# EAGLE design rpi (EAGLE 6.4)
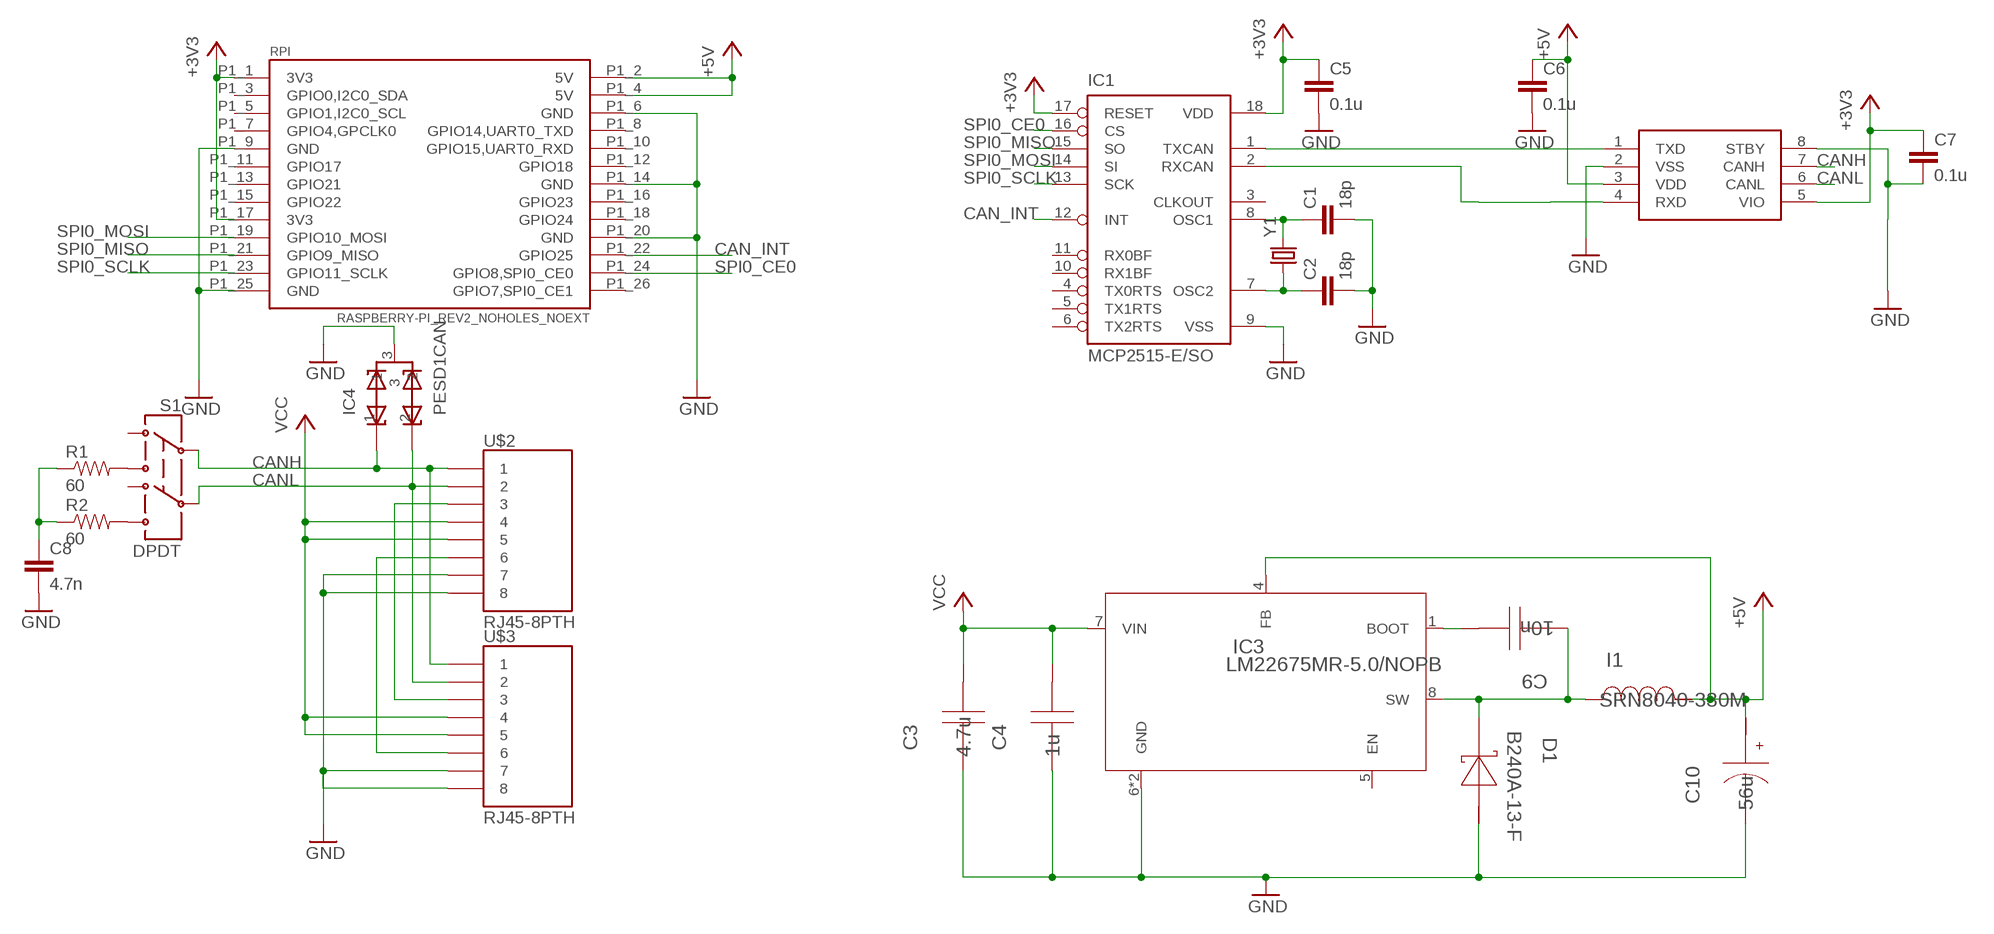
[diagram p0: schematic, sheet 1]

## Parts
C1  18p  CAP0603-CAP  [0603-CAP]
C2  18p  CAP0603-CAP  [0603-CAP]
C3  4.7u  GRM31CR71H475KA12L  [1206]
C4  1u  GMK212B7105KG-T  [0805]
C5  0.1u  CAP0603-CAP  [0603-CAP]
C6  0.1u  CAP0603-CAP  [0603-CAP]
C7  0.1u  CAP0603-CAP  [0603-CAP]
C8  4.7n  CAP0603-CAP  [0603-CAP]
C9  10n  C0805C103K5RACTU  [0805]
C10  56u  10SVP56M  [SM_RADIAL_6.3AMM]
D1  B240A-13-F  [SMA]
I1  SRN8040-330M  [SRN8040]
IC1  MCP2515-E/SO  [SO18L]
IC2  MCP2562  [SO08]
IC3  LM22675MR-5.0/NOPB  [MRA08B]
IC4  PESD1CAN  [SOT23]
R1  60  RESISTOR0603-RES  [0603-RES]
R2  60  RESISTOR0603-RES  [0603-RES]
RPI  RASPBERRY-PI_REV2_NOHOLES_NOEXT  [RASPBERRY-PI_REV2_NOHOLES_NOEXT]
S1  DPDT  SWITCH-DPDTAYZ0202  [AYZ0202]
U$2  RJ45-8PTH  [RJ45-8]
U$3  RJ45-8PTH  [RJ45-8]
Y1  CRYSTAL5X3  [CRYSTAL-SMD-5X3]

## Nets
+3V3: C5.1 C7.1 IC1.17(RESET) IC1.18(VDD) IC2.5(VIO) RPI.P1_1(3V3) RPI.P1_17(3V3)
+5V: C6.1 C10.1(+) I1.1 IC2.3(VDD) IC3.4(FB) RPI.P1_2(5V) RPI.P1_4(5V)
CAN_INT: IC1.12(INT) RPI.P1_22(GPIO25)
CANH: IC2.7(CANH) IC4.1 S1.2 U$2.1 U$3.1
CANL: IC2.6(CANL) IC4.2 S1.5 U$2.2 U$3.2
GND: C1.2 C2.2 C3.2 C4.2 C5.2 C6.2 C7.2 C8.2 C10.2(-) D1.2(A) IC1.9(VSS) IC2.2(VSS) IC2.8(STBY) IC3.6(GND) IC3.EPAD(GND) IC4.3 RPI.P1_6(GND) RPI.P1_9(GND) RPI.P1_14(GND) RPI.P1_20(GND) RPI.P1_25(GND) U$2.7 U$2.8 U$3.7 U$3.8
N$1: R1.2 S1.3
N$2: IC1.2(RXCAN) IC2.4(RXD)
N$3: IC1.1(TXCAN) IC2.1(TXD)
N$4: C1.1 IC1.8(OSC1) Y1.3
N$5: C2.1 IC1.7(OSC2) Y1.1
N$7: R2.2 S1.6
N$8: C8.1 R1.1 R2.1
N$9: U$2.3 U$3.3
N$10: U$2.6 U$3.6
N$11: C9.1 IC3.1(BOOT)
SPI0_CE0: IC1.16(CS) RPI.P1_24(GPIO8,SPI0_CE0)
SPI0_MISO: IC1.15(SO) RPI.P1_21(GPIO9_MISO)
SPI0_MOSI: IC1.14(SI) RPI.P1_19(GPIO10_MOSI)
SPI0_SCLK: IC1.13(SCK) RPI.P1_23(GPIO11_SCLK)
SWOUT: C9.2 D1.1(K) I1.2 IC3.8(SW)
VCC: C3.1 C4.1 IC3.7(VIN) U$2.4 U$2.5 U$3.4 U$3.5
Unconnected: IC1.3(CLKOUT) IC1.4(TX0RTS) IC1.5(TX1RTS) IC1.6(TX2RTS) IC1.10(RX1BF) IC1.11(RX0BF) IC3.5(EN) RPI.P1_3(GPIO0,I2C0_SDA) RPI.P1_5(GPIO1,I2C0_SCL) RPI.P1_7(GPIO4,GPCLK0) RPI.P1_8(GPIO14,UART0_TXD) RPI.P1_10(GPIO15,UART0_RXD) RPI.P1_11(GPIO17) RPI.P1_12(GPIO18) RPI.P1_13(GPIO21) RPI.P1_15(GPIO22) RPI.P1_16(GPIO23) RPI.P1_18(GPIO24) RPI.P1_26(GPIO7,SPI0_CE1) S1.1 S1.4

## Library data of the parts
C1 C2 = SparkFun-Capacitors:CAP: Capacitor Standard 0603 ceramic capacitor, and 0.1" leaded capacitor.
C3 = nickparts:GRM31CR71H475KA12L; CAP: 4.7E-6; ESR: 0.0; IRMS: 0.0; MANUFACTURER_NAME: MuRata; MANUFACTURER_PART_NUMBER: GRM31CR71H475KA12L; VDC: 50.0; VENDOR: MuRata
C4 = nickparts:GMK212B7105KG-T; CAP: 1.0E-6; ESR: 0.0; IRMS: 0.0; MANUFACTURER_NAME: Taiyo Yuden; MANUFACTURER_PART_NUMBER: GMK212B7105KG-T; VDC: 35.0; VENDOR: Taiyo Yuden
C5-C8 = SparkFun-Passives:CAP: Capacitor Standard 0603 ceramic capacitor, and 0.1" leaded capacitor.
C9 = nickparts:C0805C103K5RACTU; CAP: 1.0E-8; ESR: 1.739; IRMS: 0.411; MANUFACTURER_NAME: Kemet; MANUFACTURER_PART_NUMBER: C0805C103K5RACTU; VDC: 50.0; VENDOR: Kemet
C10 = nickparts:10SVP56M; CAP: 5.6E-5; ESR: 0.045; IRMS: 1.7; MANUFACTURER_NAME: Sanyo; MANUFACTURER_PART_NUMBER: 10SVP56M; VDC: 10.0; VENDOR: Sanyo
D1 = nickparts:B240A-13-F; DATASHEETURL: http://www.diodes.com/datasheets/ds13004.pdf; IO: 2.0; MANUFACTURER_NAME: Diodes Inc.; MANUFACTURER_PART_NUMBER: B240A-13-F; VENDOR: Diodes Inc.; VFATIO: 0.5; VRRM: 40.0
I1 = nickparts:SRN8040-330M; DATASHEETURL: http://www.bourns.com/data/global/pdfs/SRN8040.pdf; DCR: 0.145; IDC: 1.7; L: 3.3E-5; MANUFACTURER_NAME: Bourns; MANUFACTURER_PART_NUMBER: SRN8040-330M; VENDOR: Bourns
IC1 = mcp2515:MCP2515
IC2 = nickparts:MCP2562: CAN transceiver
IC3 = nickparts:LM22675MR-5.0/NOPB; DATASHEETURL: http://www.ti.com/product/lm22675; FREQUENCY: 500000.0; IMAX: 1.0; MANUFACTURER_NAME: Texas Instruments; MANUFACTURER_PART_NUMBER: LM22675MR-5.0/NOPB; MKTG_PACKAGE: NA; NSID: LM22675MRE-ADJ/NOPB; PACKAGE: NA; VENDOR: Texas Instruments
IC4 = nickparts:PESD1CAN
R1 R2 = SparkFun-Passives:RESISTOR: Resistor Basic schematic elements and footprints for 0603, 1206, and PTH resistors.
RPI = RaspberryPi:RASPBERRY-PI_REV2_NOHOLES_NOEXT
S1 = SparkFun-Electromechanical:SWITCH-DPDT: DPDT Version of the COM-00597; PROD_ID: SWCH-08179
U$2 U$3 = SparkFun-Connectors:RJ45-8: RJ45 Jack Simple RJ45, 8-pin connection - connector for common Cat5, Cat5e, and Cat6 Ethernet cables. Footprint not yet proven in production. Connector sku is PRT-00643; Breakout PCB sku is BOB-00716.
Y1 = SparkFun-FreqCtrl:CRYSTAL: Various standard crystals. Proven footprints. Spark Fun Electronics SKU : COM-00534

## Board
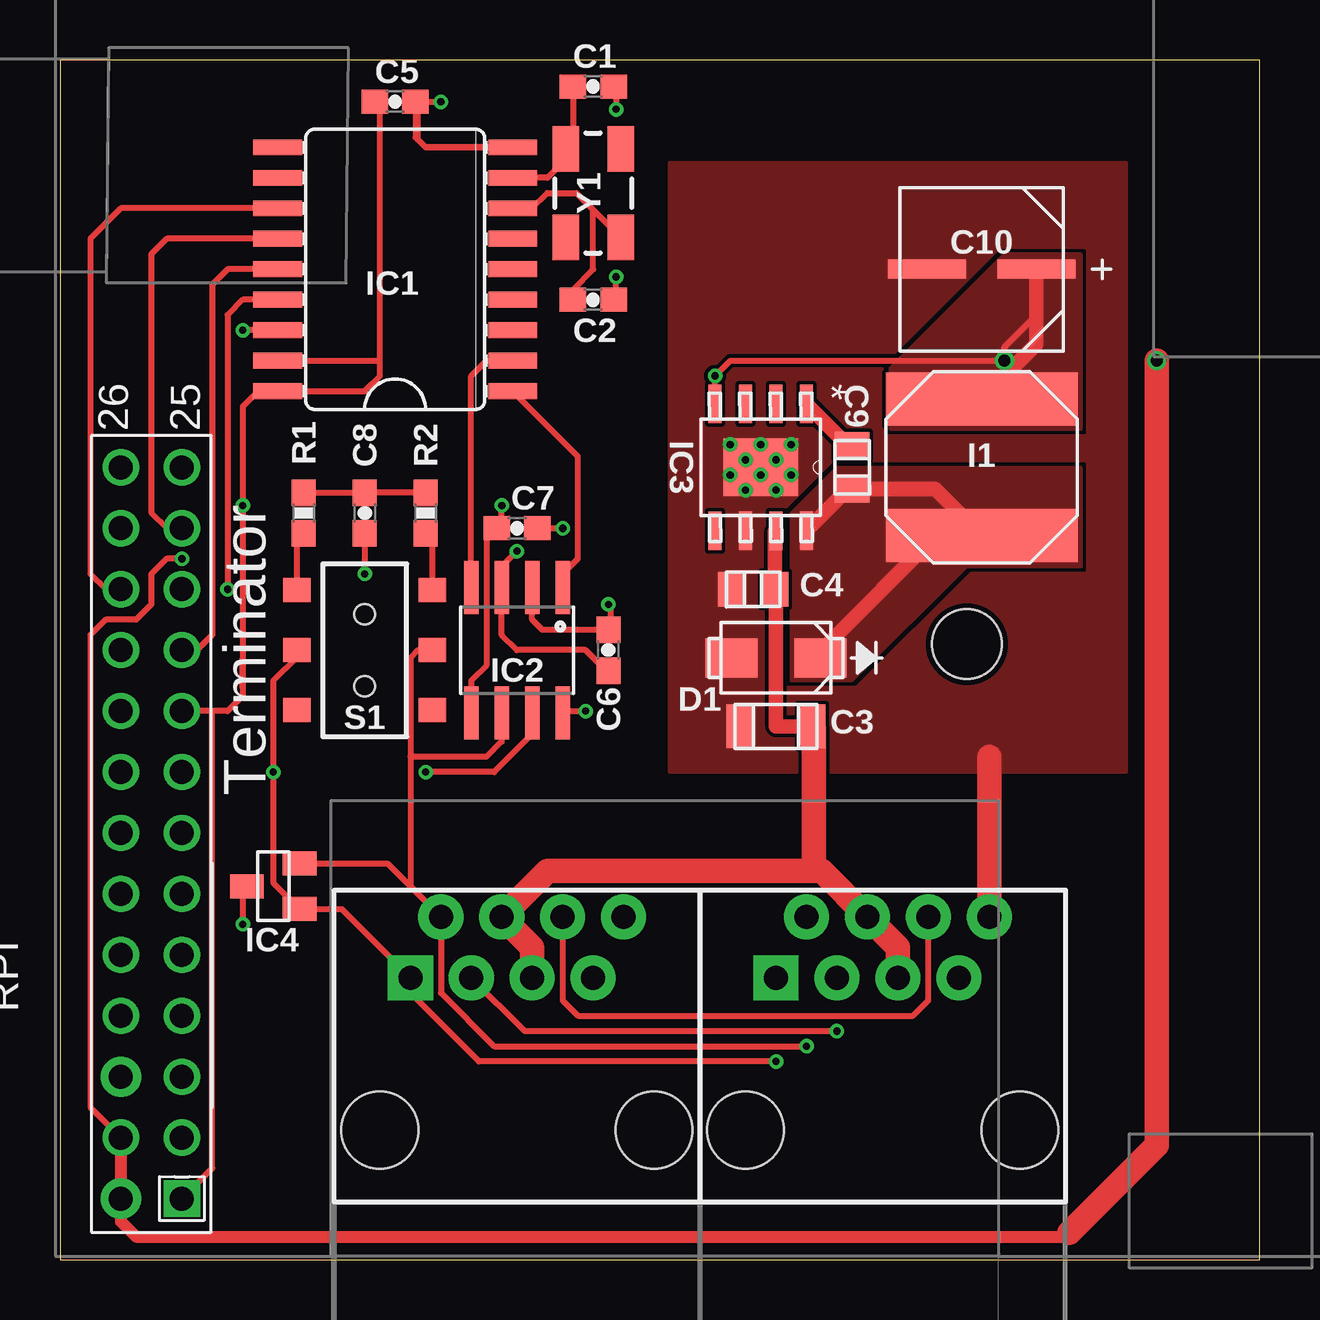
[diagram p1: board, top side]
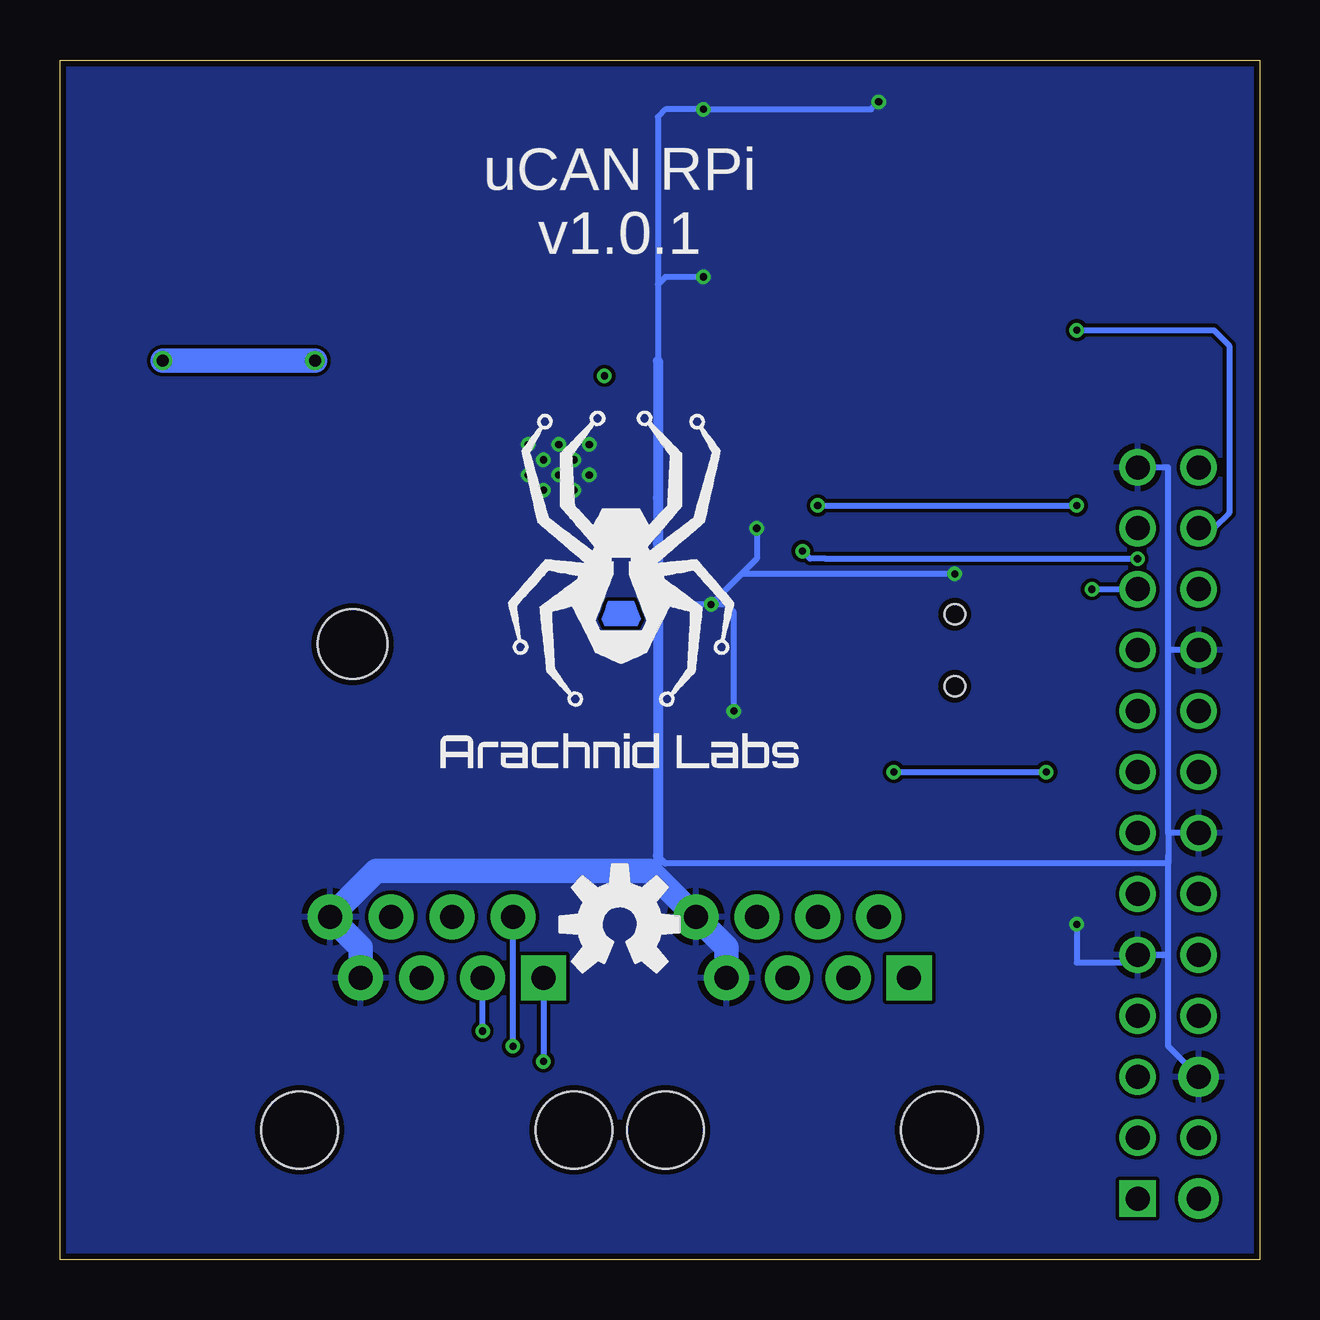
[diagram p2: board, bottom side, seen from below]

Size 50 x 50 mm. Coordinates in mm from the lower left corner, seen from the top.
Outline: 0,0 50,0 50,50 0,50 0,0
Copper layers (1*16): Top 0.035mm / dielectric 1.5mm / Bottom 0.035mm
Design rules "Fusion_eagle_rule_v1.1 *": minimum track width 6mil, minimum drill 0.3mm, track to track 6mil, track to pad 6mil, pad to pad 6mil, via to via 6mil, smd to smd 0mil, copper to edge 10mil, drill to drill 10mil, minimum pad ring 10mil, minimum via ring 6mil, stop-mask expansion 2mil, vias tented up to drill 100mil, thermal gap 10mil
Holes 2.9 mm at 37.8,25.65

### Footprints (pad centres in the part's own frame; a part is rotated, then mirrored left to right if it is on the bottom)
0603-CAP = smd 1.1 x 1: 1 -0.85,0; 2 0.85,0
1206 = smd 1.118 x 1.803: 1 -1.499,0; 2 1.499,0
0805 = smd 1.118 x 1.448: 1 -0.914,0; 2 0.914,0
SM_RADIAL_6.3AMM = smd 3.251 x 0.787: 1 -2.286,0; 2 2.286,0
SMA = smd 2.184 x 1.626: 1 -1.854,0; 2 1.854,0
SRN8040 = smd 2.21 x 8.001: 1 -2.845,0; 2 2.845,0
SO18L = smd 0.66 x 2.032: 1 -5.08,-4.902; 2 -3.81,-4.902; 3 -2.54,-4.902; 4 -1.27,-4.902; 5 0,-4.902; 6 1.27,-4.902; 7 2.54,-4.902; 8 3.81,-4.902; 9 5.08,-4.902; 10 5.08,4.902; 11 3.81,4.902; 12 2.54,4.902; 13 1.27,4.902; 14 0,4.902; 15 -1.27,4.902; 16 -2.54,4.902; 17 -3.81,4.902; 18 -5.08,4.902
SO08 = smd 0.61 x 2.21: 1 -1.905,-2.616; 2 -0.635,-2.616; 3 0.635,-2.616; 4 1.905,-2.616; 5 1.905,2.616; 6 0.635,2.616; 7 -0.635,2.616; 8 -1.905,2.616
MRA08B = smd 1.6 x 0.533: 1 -2.642,1.905; 2 -2.642,0.635; 3 -2.642,-0.635; 4 -2.642,-1.905; 5 2.642,-1.905; 6 2.642,-0.635; 7 2.642,0.635; 8 2.642,1.905 | smd 2.413 x 3.099: EPAD 0,0
SOT23 = smd 1 x 1.4: 1 -0.95,-1.1; 2 0.95,-1.1; 3 0,1.1
0603-RES = smd 1.1 x 1: 1 -0.85,0; 2 0.85,0
RASPBERRY-PI_REV2_NOHOLES_NOEXT = drill 1 square: P1_1 -41.91,21.59 | drill 1 pad 1.676: P1_2 -41.91,24.13; P1_6 -36.83,24.13 | drill 1: P1_3 -39.37,21.59; P1_4 -39.37,24.13; P1_5 -36.83,21.59; P1_7 -34.29,21.59; P1_8 -34.29,24.13; P1_9 -31.75,21.59; P1_10 -31.75,24.13; P1_11 -29.21,21.59; P1_12 -29.21,24.13; P1_13 -26.67,21.59; P1_14 -26.67,24.13; P1_15 -24.13,21.59; P1_16 -24.13,24.13; P1_17 -21.59,21.59; P1_18 -21.59,24.13; P1_19 -19.05,21.59; P1_20 -19.05,24.13; P1_21 -16.51,21.59; P1_22 -16.51,24.13; P1_23 -13.97,21.59; P1_24 -13.97,24.13; P1_25 -11.43,21.59; P1_26 -11.43,24.13
AYZ0202 = smd 1 x 1.15: 1 -2.5,2.825; 2 0,2.825; 3 2.5,2.825; 4 -2.5,-2.825; 5 0,-2.825; 6 2.5,-2.825 | hole 0.85: 1.5,0; -1.5,0
RJ45-8 = drill 1 pad 1.88 square: 1 -4.445,6.35 | drill 1 pad 1.88: 2 -3.175,8.89; 3 -1.905,6.35; 4 -0.635,8.89; 5 0.635,6.35; 6 1.905,8.89; 7 3.175,6.35; 8 4.445,8.89 | hole 3.2: -5.715,0; 5.715,0
CRYSTAL-SMD-5X3 = smd 1.9 x 1.1: 1 -1.85,-1.15; 2 1.85,-1.15; 3 1.85,1.15; 4 -1.85,1.15

### Placement (x,y rotation side)
C1  22.23,48.9 0 top
C2  22.23,40.01 0 top
C3  29.84,22.23 180 top
C4  28.89,27.94 180 top
C5  13.97,48.26 0 top
C6  22.86,25.4 90 top
C7  19.05,30.48 0 top
C8  12.7,31.11 270 top
C9  33.02,33.02 270 top
C10  38.42,41.27 180 top
D1  29.84,25.08 180 top
I1  38.42,33.02 270 top
IC1  13.97,41.27 90 top
IC2  19.05,25.4 180 top
IC3  29.21,33.02 270 top
IC4  8.89,15.56 90 top
R1  10.16,31.11 270 top
R2  15.24,31.11 270 top
RPI  26.67,44.45 90 top
S1  12.7,25.4 90 top
U$1  [ARACHNID_LABS_LOGO]  26.67,30.48 0 bottom
U$2  34.29,5.4 0 top
U$3  19.05,5.4 0 top
U$4  [OSHW-LOGO-M]  26.67,13.97 0 bottom
Y1  22.23,44.45 90 top

### Tracks (layer width: path | path; a pad name or v marks a point on that pad's centre or on a via)
+3V3  (via drill 0.3)
  Top 0.254: 13.34,37.47 13.34,36.83 12.7,36.2 IC1.18 8.26,36.2 7.62,35.56 v7.62,31.43 | 13.34,37.47 13.34,48.05 C5.1 | IC1.17 13.34,37.47 | v7.62,31.43 7.62,30.16 | 7.62,30.16 7.62,25.08 | 7.62,25.08 7.62,23.81 | 7.62,23.81 7.62,23.5 6.99,22.86 6.35,22.86 | 6.35,22.86 RPI.P1_17 | RPI.P1_1 6.35,3.81 6.35,22.86 | 7.62,23.81 7.62,25.08 | IC2.5 17.14,24.13 17.78,24.77 17.78,30.16 18.1,30.48 C7.1 18.41,30.48 v18.41,31.43 | v7.62,31.43 7.62,30.16
  Bottom 0.254: v18.41,31.43 v7.62,31.43
+5V  (via drill 0.3, 0.5)
  Top 0.254: 19.05,25.4 18.41,26.04 | 18.41,26.04 IC2.3 18.41,28.89 v19.05,29.53 | RPI.P1_4 1.27,6.35 1.27,23.5 1.27,26.04 1.91,26.67 3.17,26.67 3.81,27.3 3.81,28.57 4.45,29.21 v5.08,29.21 | C6.1 22.76,24.55 21.91,25.4 19.05,25.4 | 19.05,25.4 18.41,26.04 | IC3.4 27.3,35.88 v27.3,36.83 27.94,37.47 v39.37,37.47 39.37,38.04 40.7,39.37
  Top 0.406: RPI.P1_4 RPI.P1_2
  Top 0.508: RPI.P1_4 2.54,1.59 3.17,0.95 41.91,0.95 42.07,1.11 43.18,2.22
  Top 0.61: C10.1 40.7,39.37 40.7,38.15 I1.1
  Top 1.016: v45.72,37.47 45.72,4.76 42.07,1.11
  Bottom 0.254: v5.08,29.21 18.1,29.21 18.73,29.21 v19.05,29.53
  Bottom 1.016: v39.37,37.47 v45.72,37.47
  pour Top (no thermals): 34.61,34.61 34.61,37.15 39.37,41.91 42.55,41.91 42.55,34.61
CAN_INT
  Top 0.254: IC1.12 2.54,43.81 1.27,42.55 1.27,28.57 1.91,27.94 RPI.P1_22
CANH  (via drill 0.3)
  Top 0.254: S1.2 9.88,25.11 8.89,24.13 v8.89,20.32 | v8.89,20.32 8.89,18.73 | 8.89,18.73 8.89,15.71 IC4.1 11.74,14.61 U$3.1 14.61,11.11 17.46,8.26 v29.84,8.26 | IC2.7 19.68,21.91 18.1,20.32 v15.24,20.32 | v8.89,20.32 8.89,18.73
  Bottom 0.254: U$2.1 v29.84,8.26 | v15.24,20.32 v8.89,20.32
CANL  (via drill 0.3)
  Top 0.254: IC4.2 13.65,16.51 14.61,15.56 | 14.61,15.56 U$3.2 15.88,11.11 18.1,8.89 v31.11,8.89 | S1.5 14.92,25.4 14.61,25.08 14.61,20.95 | 14.61,20.95 14.61,15.56 | IC2.6 18.41,21.59 17.78,20.95 14.61,20.95
  Bottom 0.254: v31.11,8.89 U$2.2
GND  (via drill 0.3)
  Top 0.254: IC2.2 19.68,26.67 20.11,26.25 C6.2 22.96,26.35 22.96,27.2 v22.86,27.3 | C5.2 14.82,46.77 14.92,46.67 | 14.92,46.67 15.24,46.35 | 15.24,46.35 IC1.9 15.24,46.35 | 15.24,46.35 14.92,46.67 | 14.92,46.67 14.92,48.26 v15.88,48.26 | C1.2 23.07,48.68 23.18,48.58 v23.18,47.94 | C2.2 23.18,40.01 v23.18,40.96 | IC2.8 20.95,22.86 v21.91,22.86 | C7.2 v20.95,30.48 | C8.2 v12.7,28.57 | IC4.3 7.79,15.41 7.62,15.24 v7.62,13.97
  Top 1.016: U$2.8 38.73,20.95
  Bottom 0.254: 3.81,17.78 3.81,25.4 | 3.81,25.4 3.81,28.57 3.81,32.38 3.81,33.02 RPI.P1_25 | RPI.P1_20 3.81,25.4 | RPI.P1_14 3.81,17.78 | RPI.P1_9 3.81,12.7 | 3.81,12.7 RPI.P1_9 | 3.81,12.7 3.81,8.89 RPI.P1_6 | 25.08,40.64 25.08,47.62 24.77,47.94 v23.18,47.94 16.19,47.94 v15.88,48.26 | 25.08,40.64 25.08,37.47 | v23.18,40.96 24.77,40.96 25.08,40.64 | v22.86,27.3 22.23,27.3 21.91,26.99 v21.91,22.86 | v22.86,27.3 25.08,27.3 | v20.95,30.48 20.95,29.21 v22.86,27.3 | v12.7,28.57 21.59,28.57 v22.86,27.3 | RPI.P1_9 5.4,12.38 7.62,12.38 v7.62,13.97 | 3.81,17.78 3.81,16.83 | 3.81,16.83 3.81,16.51 24.77,16.51 25.08,16.83 | 3.81,12.7 3.81,16.83
  Bottom 0.406: 25.08,37.47 25.08,31.75 25.08,29.84 25.08,27.3 25.08,16.83 25.08,16.51 25.4,16.19
  Bottom 1.016: U$2.7 37.47,13.02 U$2.8 36.83,16.19 25.4,16.19 U$3.8 22.23,13.02 U$3.7
  other vias: 27.94,33.97 29.21,33.97 30.48,33.97 29.84,33.34 28.57,33.34 27.94,32.7 29.21,32.7 30.48,32.7 28.57,32.07 29.84,32.07
  pour Top (rank 2, no thermals): 25.4,20.32 44.45,20.32 44.45,45.72 25.4,45.72
  pour Bottom: 0,0 50.8,0 50.8,50.8 0,50.8
N$1
  Top 0.254: S1.3 9.88,29.98 R1.2
N$2
  Top 0.254: IC2.4 17.14,36.83 17.78,37.47 IC1.2
N$3
  Top 0.254: IC2.1 20.95,28.57 21.59,29.21 21.59,33.48 IC1.1
N$4
  Top 0.254: IC1.8 20.32,45.09 21.07,45.84 Y1.3 21.38,46.6 C1.1
N$5
  Top 0.254: IC1.7 19.68,43.81 20.32,44.45 21.52,44.45 22.19,43.78 | 22.19,43.78 Y1.1 | C2.1 21.38,40.42 22.23,41.27 22.23,43.75 22.19,43.78
N$7
  Top 0.254: S1.6 15.53,29.98 R2.2
N$8
  Top 0.254: R2.1 C8.1 R1.1
N$9  (via drill 0.3)
  Top 0.254: U$3.3 19.37,9.53 v32.38,9.53
  Bottom 0.254: v32.38,9.53 U$2.3
N$10
  Top 0.254: U$3.6 20.95,10.79 21.59,10.16 35.56,10.16 36.2,10.79 U$2.6
N$11
  Top 0.61: C9.1 32.84,33.93 IC3.1
SPI0_CE0  (via drill 0.3)
  Top 0.254: IC1.16 v7.62,38.73
  Bottom 0.254: v7.62,38.73 4.45,38.73 1.91,38.73 1.27,38.1 1.27,31.11 1.91,30.48 RPI.P1_24
SPI0_MISO  (via drill 0.3)
  Top 0.254: IC1.15 7.62,40.01 6.99,39.37 v6.99,27.94
  Bottom 0.254: v6.99,27.94 RPI.P1_21
SPI0_MOSI
  Top 0.254: IC1.14 6.99,41.27 6.35,40.64 6.35,26.04 5.71,25.4 RPI.P1_19
SPI0_SCLK
  Top 0.254: IC1.13 4.45,42.55 3.81,41.91 3.81,31.11 4.45,30.48 RPI.P1_23
SWOUT
  Top 0.61: IC3.8 32.84,32.11 C9.2 36.49,32.11 I1.2 38.11,30.48 36.83,30.48 31.7,25.35 D1.1
  pour Top (no thermals): 30.48,24.13 30.48,31.11 32.38,33.02 42.55,33.02 42.55,28.89 37.78,28.89 33.02,24.13
VCC
  Top 0.61: C3.1 29.84,22.23 29.84,27.9 C4.1 29.81,30.34 IC3.7
  Top 1.016: U$2.5 34.92,13.02 U$2.4 31.75,16.19 31.43,16.19 | U$3.5 19.68,13.02 U$3.4 20.32,16.19 31.43,16.19 | 31.43,16.19 31.43,22.14 C3.1

### Text on the board
tNames: Terminator
bNames: uCAN RPi / v1.0.1